# Altium schematic sheet Sheet_1_2021-06-19.schdoc
size 341 x 207 mm
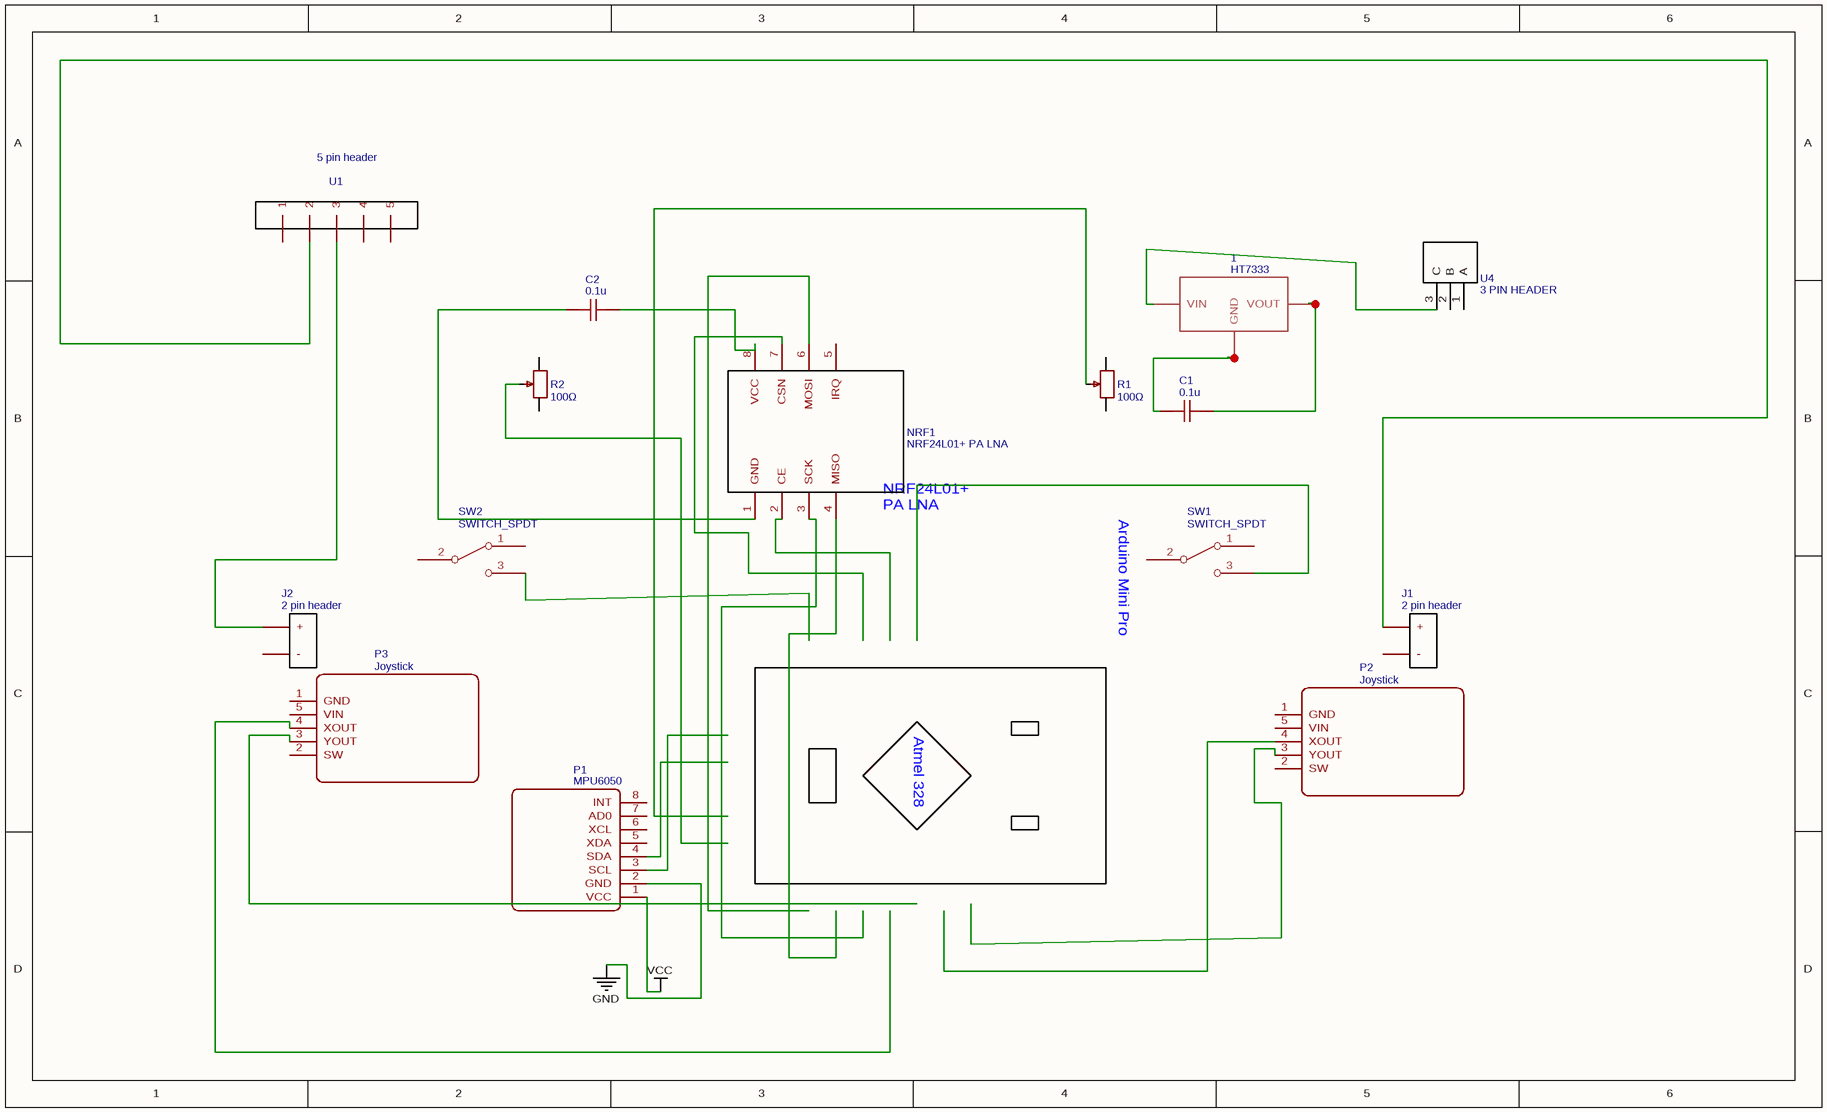
[diagram p0: Sheet_1_2021-06-19.schdoc]

## Parts
1  HT7333  [SOT89]
C1  0.1u  [C0603]
C2  0.1u  [C0603]
J1  2 pin header  [2 PIN HEADER]
J2  2 pin header  [2 PIN HEADER]
NRF1  NRF24L01+ PA LNA  [NRF24L01+ PA LNA]
P1  MPU6050  [MPU6050]
P2  Joystick  [JOYSTICK]
P3  Joystick  [JOYSTICK]
R1  100Ω  [VERTICAL POT]
R2  100Ω  [VERTICAL POT]
SW1  SWITCH_SPDT  [SPDT TOGGLE SWITCH]
SW2  SWITCH_SPDT  [SPDT TOGGLE SWITCH]
U1  5 pin header
U4  3 PIN HEADER  [3 PIN HEADER]

## Nets
GND: P1.2(GND)
VCC: P1.1(VCC)
Net1_GND: 1.GND C1.1
Net1_VIN: 1.VIN U4.3(C)
Net1_VOUT: 1.VOUT C1.2
NetC2_1: C2.1 NRF1.1(GND)
NetC2_2: C2.2 NRF1.8(VCC)
NetJ1_1: J1.1(+) U1.2
NetJ2_1: J2.1(+) U1.3

Not connected (* = marked no-connect by the designer): J1 2(-); J2 2(-); NRF1 2(CE) 3(SCK) 4(MISO) 5(IRQ) 6(MOSI) 7(CSN); P1 3(SCL) 4(SDA) 5(XDA) 6(XCL) 7(AD0) 8(INT); P2 1(GND) 2(SW) 3(YOUT) 4(XOUT) 5(VIN); P3 1(GND) 2(SW) 3(YOUT) 4(XOUT) 5(VIN); R1 1 2 3; R2 1 2 3; SW1 1 2 3; SW2 1 2 3; U1 1 4 5; U4 1(A) 2(B)

## Notes on the sheet
- Arduino Mini Pro
- Atmel 328
- (in symbol NRF24L01+ PA LNA) NRF24L01+ / PA LNA

## Library data of the parts
1 = HT7333: Contributor: jay chauhan; spicePre: ?; spiceSymbolName: HT7333
C1 C2 = 0.1u: nameAlias: Value(F); Contributor: LCEDA_Lib; spicePre: C; spiceSymbolName: C_0603_US
J1 J2 = 2 pin header: Contributor: tcirineo; timeStamp: 1476325223; spicePre: J; spiceSymbolName: 2 pin header
NRF1 = NRF24L01+ PA LNA: Contributor: irukard; sourceId: diuGEeOLl; BOM_Supplier Part: NRF24L01p-PA-LNA; BOM_Supplier: Nettigo; timeStamp: 1474317156; spicePre: N; spiceSymbolName: NRF24L01+ PA LNA
P1 = MPU6050: sourceId: 1T5FDZYC8; Contributor: Mr. Sandman; timeStamp: 1462265206; spicePre: P; spiceSymbolName: MPU6050
P2 P3 = Joystick: sourceId: 1T5FDZYC8; Contributor: shubham kumar; timeStamp: 1459417765; BOM_Supplier: AdaFruit; spicePre: P; spiceSymbolName: Joystick
R1 R2 = 100Ω: BOM_Manufacturer Part: Precision potentiometer100Ω; nameAlias: Value; spicePre: R; spiceSymbolName: VERTICAL POTENTIOMETER
SW1 SW2 = SWITCH_SPDT: sourceId: nHdvpHBSa; timeStamp: 1471889847; spicePre: S; spiceSymbolName: SWITCH_SPDT
U1 = 5 pin header: Contributor: alberto.perez.madruga; spicePre: U; spiceSymbolName: 5 pin header
U4 = 3 PIN HEADER: Contributor: Deimoss; BOM_Manufacturer Part: 3 pin header; spicePre: U; spiceSymbolName: 3 PIN HEADER